# EAGLE design VCA1.1 (EAGLE 9.6.1)
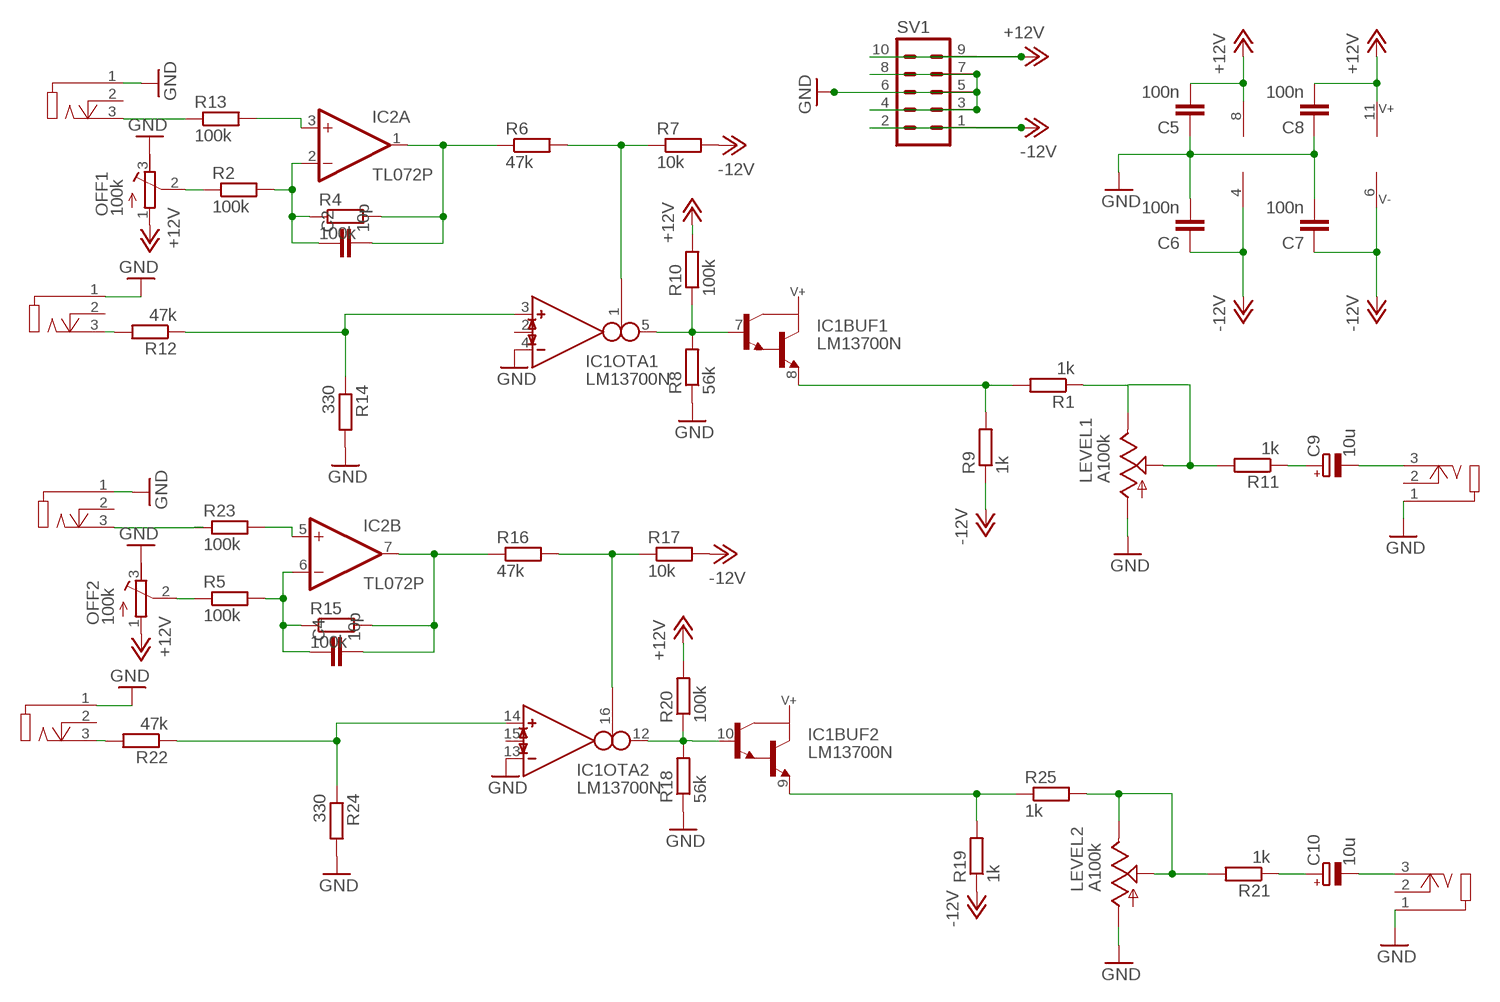
[diagram p0: schematic, sheet 1]

## Parts
C2  10p  C-EU025-024X044  [C025-024X044]
C4  10p  C-EU025-024X044  [C025-024X044]
C5  100n  C-EU025-024X044  [C025-024X044]
C6  100n  C-EU025-024X044  [C025-024X044]
C7  100n  C-EU025-024X044  [C025-024X044]
C8  100n  C-EU025-024X044  [C025-024X044]
C9  10u  CPOL-EUE2,5-6E  [E2,5-6E]
C10  10u  CPOL-EUE2,5-6E  [E2,5-6E]
CV1  3.5MM_MONO_SWITCH_VERT  [PJ398SM]
CV2  3.5MM_MONO_SWITCH_VERT  [PJ398SM]
IC1  LM13700N  [DIL16]
IC2  TL072P  [DIL08]
IN1  3.5MM_MONO_SWITCH_VERT  [PJ398SM]
IN2  3.5MM_MONO_SWITCH_VERT  [PJ398SM]
LEVEL1  A100k  PTV09-4420  [PTV09]
LEVEL2  A100k  PTV09-4420  [PTV09]
OFF1  100k  R-TRIMM3296X  [RTRIM3296X]
OFF2  100k  R-TRIMM3296X  [RTRIM3296X]
OUT1  3.5MM_MONO_SWITCH_VERT  [PJ398SM]
OUT2  3.5MM_MONO_SWITCH_VERT  [PJ398SM]
R1  1k  R-EU_0204/7  [0204/7]
R2  100k  R-EU_0204/7  [0204/7]
R4  100k  R-EU_0204/7  [0204/7]
R5  100k  R-EU_0204/7  [0204/7]
R6  47k  R-EU_0204/7  [0204/7]
R7  10k  R-EU_0204/7  [0204/7]
R8  56k  R-EU_0204/7  [0204/7]
R9  1k  R-EU_0204/7  [0204/7]
R10  100k  R-EU_0204/7  [0204/7]
R11  1k  R-EU_0204/7  [0204/7]
R12  47k  R-EU_0204/7  [0204/7]
R13  100k  R-EU_0204/7  [0204/7]
R14  330  R-EU_0204/7  [0204/7]
R15  100k  R-EU_0204/7  [0204/7]
R16  47k  R-EU_0204/7  [0204/7]
R17  10k  R-EU_0204/7  [0204/7]
R18  56k  R-EU_0204/7  [0204/7]
R19  1k  R-EU_0204/7  [0204/7]
R20  100k  R-EU_0204/7  [0204/7]
R21  1k  R-EU_0204/7  [0204/7]
R22  47k  R-EU_0204/7  [0204/7]
R23  100k  R-EU_0204/7  [0204/7]
R24  330  R-EU_0204/7  [0204/7]
R25  1k  R-EU_0204/7  [0204/7]
SV1  ML10  [ML10]

## Nets
+12V: C5.2 C8.2 IC1.11(SUPPLY:V+) IC2.8(P:V+) OFF1.1(A) OFF2.1(A) R10.2 R20.2 SV1.9 SV1.10
-12V: C6.1 C7.1 IC1.6(SUPPLY:V-) IC2.4(P:V-) R7.2 R9.1 R17.2 R19.1 SV1.1 SV1.2
GND: C5.1 C6.2 C7.2 C8.1 CV1.1 CV2.1 IC1.4(OTA1:IN_N) IC1.13(OTA2:IN_N) IN1.1 IN2.1 LEVEL1.1(A) LEVEL2.1(A) OFF1.3(E) OFF2.3(E) OUT1.1 OUT2.1 R8.1 R14.2 R18.1 R24.2 SV1.3 SV1.4 SV1.5 SV1.6 SV1.7 SV1.8
N$1: C2.1 IC2.2(A:-IN) R2.2 R4.1
N$2: IC2.3(A:+IN) R13.2
N$3: IC1.3(OTA1:IN_P) R12.1 R14.1
N$4: C2.2 IC2.1(A:OUT) R4.2 R6.1
N$5: OFF1.2(S) R2.1
N$6: IC1.1(OTA1:I_BIAS) R6.2 R7.1
N$7: IC1.5(OTA1:OUT) IC1.7(BUF1:B) R8.2 R10.1
N$8: IN1.3 R12.2
N$10: CV1.3 R13.1
N$11: C4.1 IC2.6(B:-IN) R5.2 R15.1
N$12: IC1.8(BUF1:E) R1.2 R9.2
N$13: LEVEL1.2(S) LEVEL1.3(E) R1.1 R11.2
N$14: C9.+ R11.1
N$15: C9.- OUT1.3
N$16: C4.2 IC2.7(B:OUT) R15.2 R16.1
N$17: IC1.16(OTA2:I_BIAS) R16.2 R17.1
N$18: IC1.10(BUF2:B) IC1.12(OTA2:OUT) R18.2 R20.1
N$19: IN2.3 R22.2
N$21: IC1.9(BUF2:E) R19.2 R25.1
N$22: LEVEL2.2(S) LEVEL2.3(E) R21.2 R25.2
N$23: C10.+ R21.1
N$24: C10.- OUT2.3
N$26: OFF2.2(S) R5.1
N$27: CV2.3 R23.1
N$28: IC2.5(B:+IN) R23.2
N$30: IC1.14(OTA2:IN_P) R22.1 R24.1
Unconnected: CV1.2 CV2.2 IC1.2(OTA1:I_DIODE) IC1.15(OTA2:I_DIODE) IN1.2 IN2.2 OUT1.2 OUT2.2

## Library data of the parts
C2 C4-C8 = rcl:C-EU: CAPACITOR, European symbol; SPICEPREFIX: C
C9 C10 = rcl:CPOL-EU: POLARIZED CAPACITOR, European symbol; SPICEPREFIX: C
CV1 CV2 IN1 IN2 OUT1 OUT2 = con-audio:3.5MM_MONO_SWITCH_VERT: 3.5mm Vertical audio jack w switch https://www.uk-electronic.de/onlineshop/product_info.php?products_id=4465
IC1 = ota:LM13700: Dual OTA with buffers
IC2 = linear:TL072: OP AMP
LEVEL1 LEVEL2 = PTV09:PTV09; AVAILABILITY: Unavailable; DESCRIPTION: Instant Conn Red 22-18awg 100/Box; MF: Nichifu; MP: PTV-09; PACKAGE: None; PRICE: None
OFF1 OFF2 = rcl:R-TRIMM: Trimm resistor; SPICEMODEL: X; SPICEPREFIXL: POT
R1 R2 R4-R25 = rcl:R-EU_: RESISTOR, European symbol; SPICEPREFIX: R
SV1 = con-ml:ML10: HARTING; OC_FARNELL: unknown; OC_NEWARK: unknown

## Net classes
0 default: width 0.6 mm

## Board
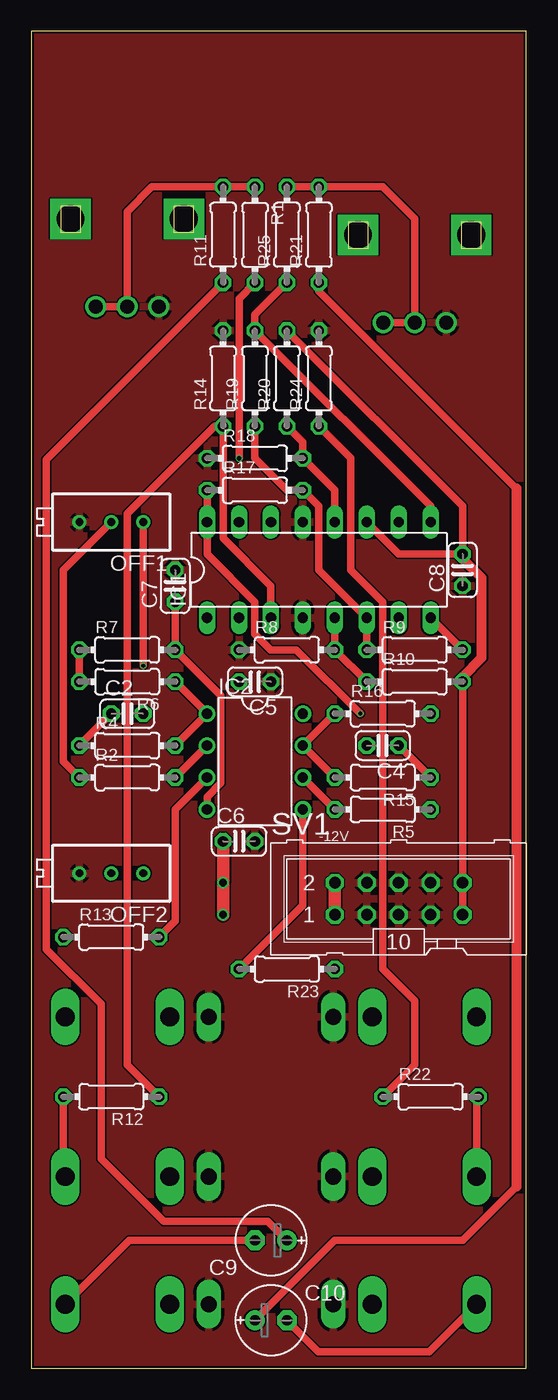
[diagram p1: board, top side]
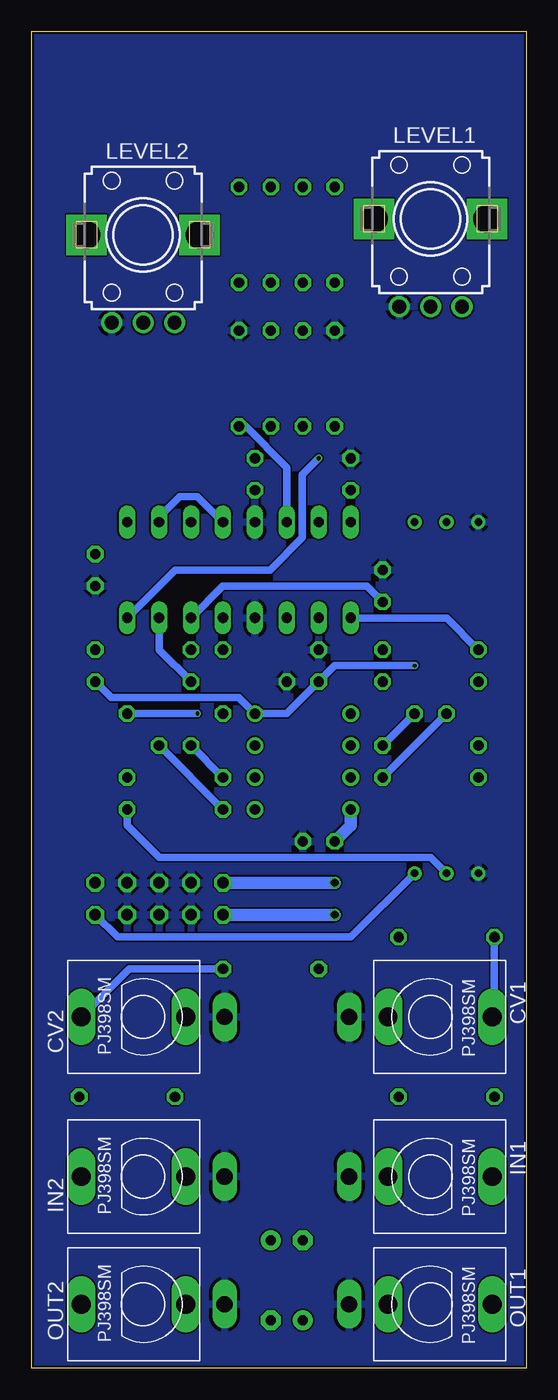
[diagram p2: board, bottom side, seen from below]

Size 39.35 x 106.35 mm. Coordinates in mm from the lower left corner, seen from the top.
Outline: 0,0 39.35,0 39.35,106.35 0,106.35 0,0
Copper layers (1*16): Top 0.035559375mm / dielectric 1.6mm / Bottom 0.035559375mm
Design rules "jlcpcb2layer *": minimum track width 5mil, minimum drill 12mil, track to track 5mil, track to pad 5mil, pad to pad 5mil, via to via 5mil, smd to smd 5mil, copper to edge 8mil, drill to drill 6mil, minimum pad ring 10mil, minimum via ring 3mil, stop-mask expansion 2.5mil, vias tented up to drill 0mil, thermal gap 10mil

### Footprints (pad centres in the part's own frame; a part is rotated, then mirrored left to right if it is on the bottom)
C025-024X044 = drill 0.813 octagon: 1 -1.27,0; 2 1.27,0
E2,5-6E = drill 0.813 pad 1.575: + -1.27,0 | drill 0.813 pad 1.575 octagon: - 1.27,0
PJ398SM = drill 1.3 pad 1.8 long: 1 0,-6.48 | drill 1.5 pad 1.8 long: 2 0,-3.38; 3 0,4.92
DIL16 = drill 0.813 long: 1 -8.89,-3.81; 2 -6.35,-3.81; 3 -3.81,-3.81; 4 -1.27,-3.81; 5 1.27,-3.81; 6 3.81,-3.81; 7 6.35,-3.81; 8 8.89,-3.81; 9 8.89,3.81; 10 6.35,3.81; 11 3.81,3.81; 12 1.27,3.81; 13 -1.27,3.81; 14 -3.81,3.81; 15 -6.35,3.81; 16 -8.89,3.81
DIL08 = drill 0.813 pad 1.27: 1 -3.81,-3.81; 2 -1.27,-3.81; 3 1.27,-3.81; 4 3.81,-3.81; 5 3.81,3.81; 6 1.27,3.81; 7 -1.27,3.81; 8 -3.81,3.81
PTV09 = drill 1.1 pad 1.676: 1 -2.5,-7; 2 0,-7; 3 2.5,-7 | drill 2.2 square: M1 4.5,0; M2 -4.5,0
RTRIM3296X = drill 0.61: 1 0,-2.54; 2 0,0; 3 0,2.54
0204/7 = drill 0.813 octagon: 1 -3.81,0; 2 3.81,0
ML10 = drill 0.914 octagon: 1 -5.08,-1.27; 2 -5.08,1.27; 3 -2.54,-1.27; 4 -2.54,1.27; 5 0,-1.27; 6 0,1.27; 7 2.54,-1.27; 8 2.54,1.27; 9 5.08,-1.27; 10 5.08,1.27

### Placement (x,y rotation side)
C2  7.62,52.07 0 top
C4  27.94,49.53 180 top
C5  17.78,54.61 180 top
C6  16.51,41.91 0 top
C7  11.43,62.23 90 top
C8  34.29,63.5 90 top
C9  19.05,10.16 180 top
C10  19.05,3.81 0 top
CV1  7.62,27.94 270 bottom
CV2  30.48,27.94 90 bottom
IC1  22.86,63.5 0 top
IC2  17.78,48.26 270 top
IN1  7.62,15.24 270 bottom
IN2  30.48,15.24 90 bottom
LEVEL1  7.62,91.44 0 bottom
LEVEL2  30.48,90.17 0 bottom
OFF1  6.35,67.31 90 top
OFF2  6.35,39.37 90 top
OUT1  7.62,5.08 270 bottom
OUT2  30.48,5.08 90 bottom
R1  17.78,90.17 270 top
R2  7.62,46.99 0 top
R4  7.62,49.53 0 top
R5  27.94,44.45 180 top
R6  7.62,54.61 180 top
R7  7.62,57.15 0 top
R8  20.32,57.15 0 top
R9  30.48,57.15 0 top
R10  30.48,54.61 0 top
R11  15.24,90.17 90 top
R12  6.35,21.59 180 top
R13  6.35,34.29 0 top
R14  15.24,78.74 90 top
R15  27.94,46.99 180 top
R16  27.94,52.07 0 top
R17  17.78,69.85 0 top
R18  17.78,72.39 0 top
R19  17.78,78.74 90 top
R20  20.32,78.74 90 top
R21  22.86,90.17 90 top
R22  31.75,21.59 0 top
R23  20.32,31.75 180 top
R24  22.86,78.74 90 top
R25  20.32,90.17 90 top
SV1  29.21,37.34 0 top

### Tracks (layer width: path | path; a pad name or v marks a point on that pad's centre or on a via)
+12V  (via drill 0.3)
  Top 0.6: SV1.9 SV1.10 R10.2 | IC1.11 29.21,64.77 C8.2 34.29,68.58 R20.2 | v8.89,55.88 OFF1.1
  Top 0.8: R10.2 34.29,55 35.81,56.52 35.81,62.86 34.29,64.38 C8.2
  Bottom 0.6: R10.2 33.02,53.34 22.86,53.34 IC2.8 19.05,52.07 C5.2 15.24,55.88 v8.89,55.88 | SV1.9 32.51,34.29 13.97,34.29 OFF2.1
-12V  (via drill 0.6)
  Top 0.6: R9.1 IC1.6 22.86,63.5 22.86,68.58 R17.2 20.32,69.85 17.78,72.39 R19.1 | C7.1 R7.2 15.06,53.52 15.06,46.54 13.97,45.45 IC2.4
  Top 1: SV1.1 SV1.2 | C6.1 v15.24,38.61 v15.24,36.07
  Bottom 0.6: C7.1 12.7,62.23 24.13,62.23 IC1.6
  Bottom 1: IC2.4 13.97,43.18 C6.1 | v15.24,38.61 SV1.2 | SV1.1 v15.24,36.07
GND
  pour Bottom: 0,106.68 40.64,106.68 40.64,-1.27 -1.27,-1.27 -1.27,106.68
  pour Top: -1.27,106.68 43.18,106.68 43.18,-1.27 -1.27,-1.27 -1.27,105.41
N$1
  Top 0.6: C2.1 R4.1 | R2.2 IC2.2
  Bottom 0.6: C2.1 R2.2
N$2
  Top 0.6: R13.2 11.43,35.56 11.43,44.45 IC2.3
N$3
  Top 0.6: R12.1 7.62,24.13 7.62,67.97 14.58,74.93 R14.1 15.24,66.04 19.05,62.23 IC1.3
N$4
  Top 0.6: R6.1 IC2.1 R4.2
  Bottom 0.6: R4.2 C2.2
N$5
  Top 0.6: R2.1 2.54,48.26 2.54,63.5 OFF1.2
N$6
  Top 0.6: R7.1 R6.2
  Bottom 0.6: R7.1 6.35,59.69 IC1.1
N$7
  Top 0.6: IC1.5 R8.2 R10.1
  Bottom 0.6: R10.1 29.21,57.15 IC1.7
N$8
  Top 0.6: IN1.3 2.54,15.24 R12.2
N$10
  Bottom 0.6: CV1.3 2.54,28.1 R13.1
N$11
  Top 0.6: IC2.6 R5.2 | C4.1 R15.1
  Bottom 0.6: R5.2 C4.1
N$12  (via drill 0.35)
  Top 0.6: R9.2 IC1.8 | v16.51,72.39 16.51,85.09 R1.2
  Bottom 0.6: v16.51,72.39 17.81,71.09 17.81,66.06 20.37,63.5 27.94,63.5 IC1.8
N$13
  Top 0.6: LEVEL1.3 LEVEL1.2 7.62,92.02 9.59,93.99 R11.2 R1.1
N$14
  Top 0.6: C9.+ 18.8,11.68 10.52,11.68 5.55,16.66 5.55,28.96 1.17,33.33 1.17,72.29 R11.1
N$15
  Top 0.6: OUT1.3 7.78,10.16 C9.-
N$16
  Top 0.6: R16.1 IC2.7 R15.2
  Bottom 0.6: R15.2 C4.2
N$17  (via drill 0.3)
  Top 0.6: R17.1 IC1.16 13.97,64.77 17.78,60.96 17.78,58.42 19.05,57.15 21.08,57.15 v26.16,52.07
  Bottom 0.6: R16.2 v26.16,52.07
N$18
  Top 0.6: R20.1 21.59,73.66 R18.2 24.13,69.85 IC1.12
  Bottom 0.6: IC1.10 29.21,67.69 27.56,69.34 26.16,69.34 IC1.12
N$19
  Top 0.6: IN2.3 35.4,21.43 R22.2
N$21
  Top 0.6: R25.1 17.78,83.82 R19.2 31.75,68.58 IC1.9
N$22
  Top 0.6: LEVEL2.3 LEVEL2.2 30.48,91.44 27.94,93.98 R21.2 R25.2
N$23
  Top 0.6: C10.+ 24.13,10.16 34.29,10.16 38.56,14.43 | 38.56,69.99 22.86,85.7 R21.1
  Top 0.8: 38.56,69.99 38.56,14.43
N$24
  Top 0.6: OUT2.3 31.64,1.32 22.81,1.32 C10.-
N$26
  Bottom 0.6: OFF2.2 7.62,40.64 29.21,40.64 31.75,43.18 R5.1
N$27
  Bottom 0.6: R23.1 31.59,31.75 CV2.3
N$28
  Top 0.6: R23.2 21.59,36.83 IC2.5
N$30
  Top 0.6: R22.1 30.48,24.13 30.48,29.21 27.94,31.75 27.94,60.96 25.4,63.5 25.4,72.39 R24.1
  Bottom 0.6: IC1.14 19.05,71.64 22.34,74.93 R24.1

### Text on the board
tNames: -12V
Document: Pandamic
tDocu: -12 | -12V | GND | +12V | not for racist use. | Gute Laune VCA | V1.1 - Victor Höller - 2020